# EAGLE design 03_MotorStage_v1 (EAGLE 9.6.2)

## Sheet 1 of 2
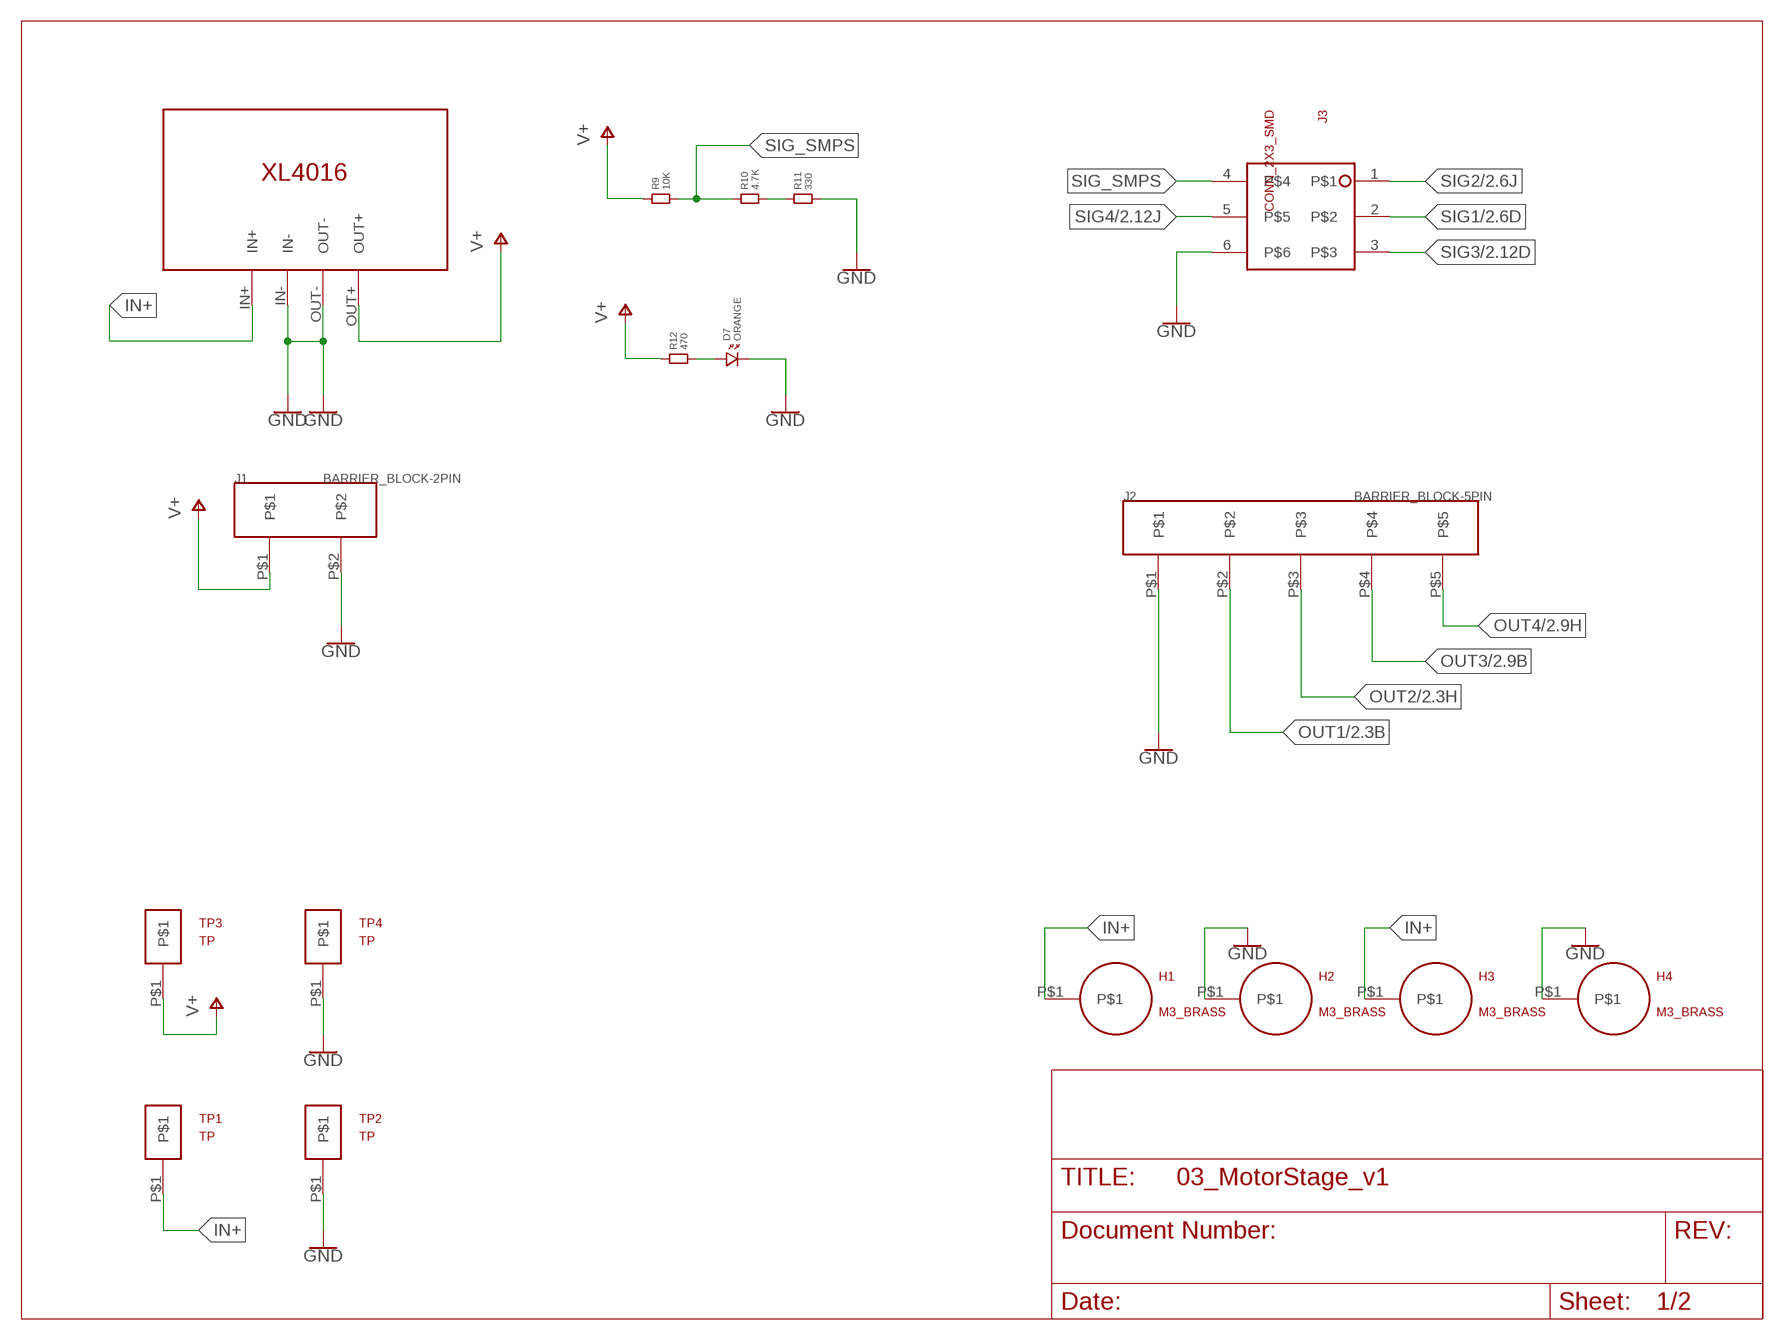
[diagram p0: schematic, sheet 1]

### Parts
D7  ORANGE  LED.1206  [1206.LED]
H1  M3_BRASS  [M3_BRASS]
H2  M3_BRASS  [M3_BRASS]
H3  M3_BRASS  [M3_BRASS]
H4  M3_BRASS  [M3_BRASS]
J1  BARRIER_BLOCK-2PIN  [BARRIERBLOCK-2PIN]
J2  BARRIER_BLOCK-5PIN  [BARRIERBLOCK-5PIN]
J3  CONN_2X3_SMD  [2X3_SMD_CONNECTOR]
R9  10K  RESISTOR.1206  [1206]
R10  4.7K  RESISTOR.1206  [1206]
R11  330  RESISTOR.1206  [1206]
R12  470  RESISTOR.1206  [1206]
TP1  TP  [TP]
TP2  TP  [TP]
TP3  TP  [TP]
TP4  TP  [TP]
U1  XL4016-DEV  [XL4016-DEV]

### Nets
GND: D7.P$2 H2.P$1 H4.P$1 J1.P$2 J2.P$1 J3.6 R11.2 TP2.P$1 TP4.P$1 U1.IN- U1.OUT- ; also sheet 2
IN+: H1.P$1 H3.P$1 TP1.P$1 U1.IN+
N$1: D7.P$1 R12.2
N$23: R10.2 R11.1
OUT1: J2.P$2 ; also sheet 2
OUT2: J2.P$3 ; also sheet 2
OUT3: J2.P$4 ; also sheet 2
OUT4: J2.P$5 ; also sheet 2
SIG1: J3.2 ; also sheet 2
SIG2: J3.1 ; also sheet 2
SIG3: J3.3 ; also sheet 2
SIG4: J3.5 ; also sheet 2
SIG_SMPS: J3.4 R9.2 R10.1
V+: J1.P$1 R9.1 R12.1 TP3.P$1 U1.OUT+ ; also sheet 2

## Sheet 2 of 2
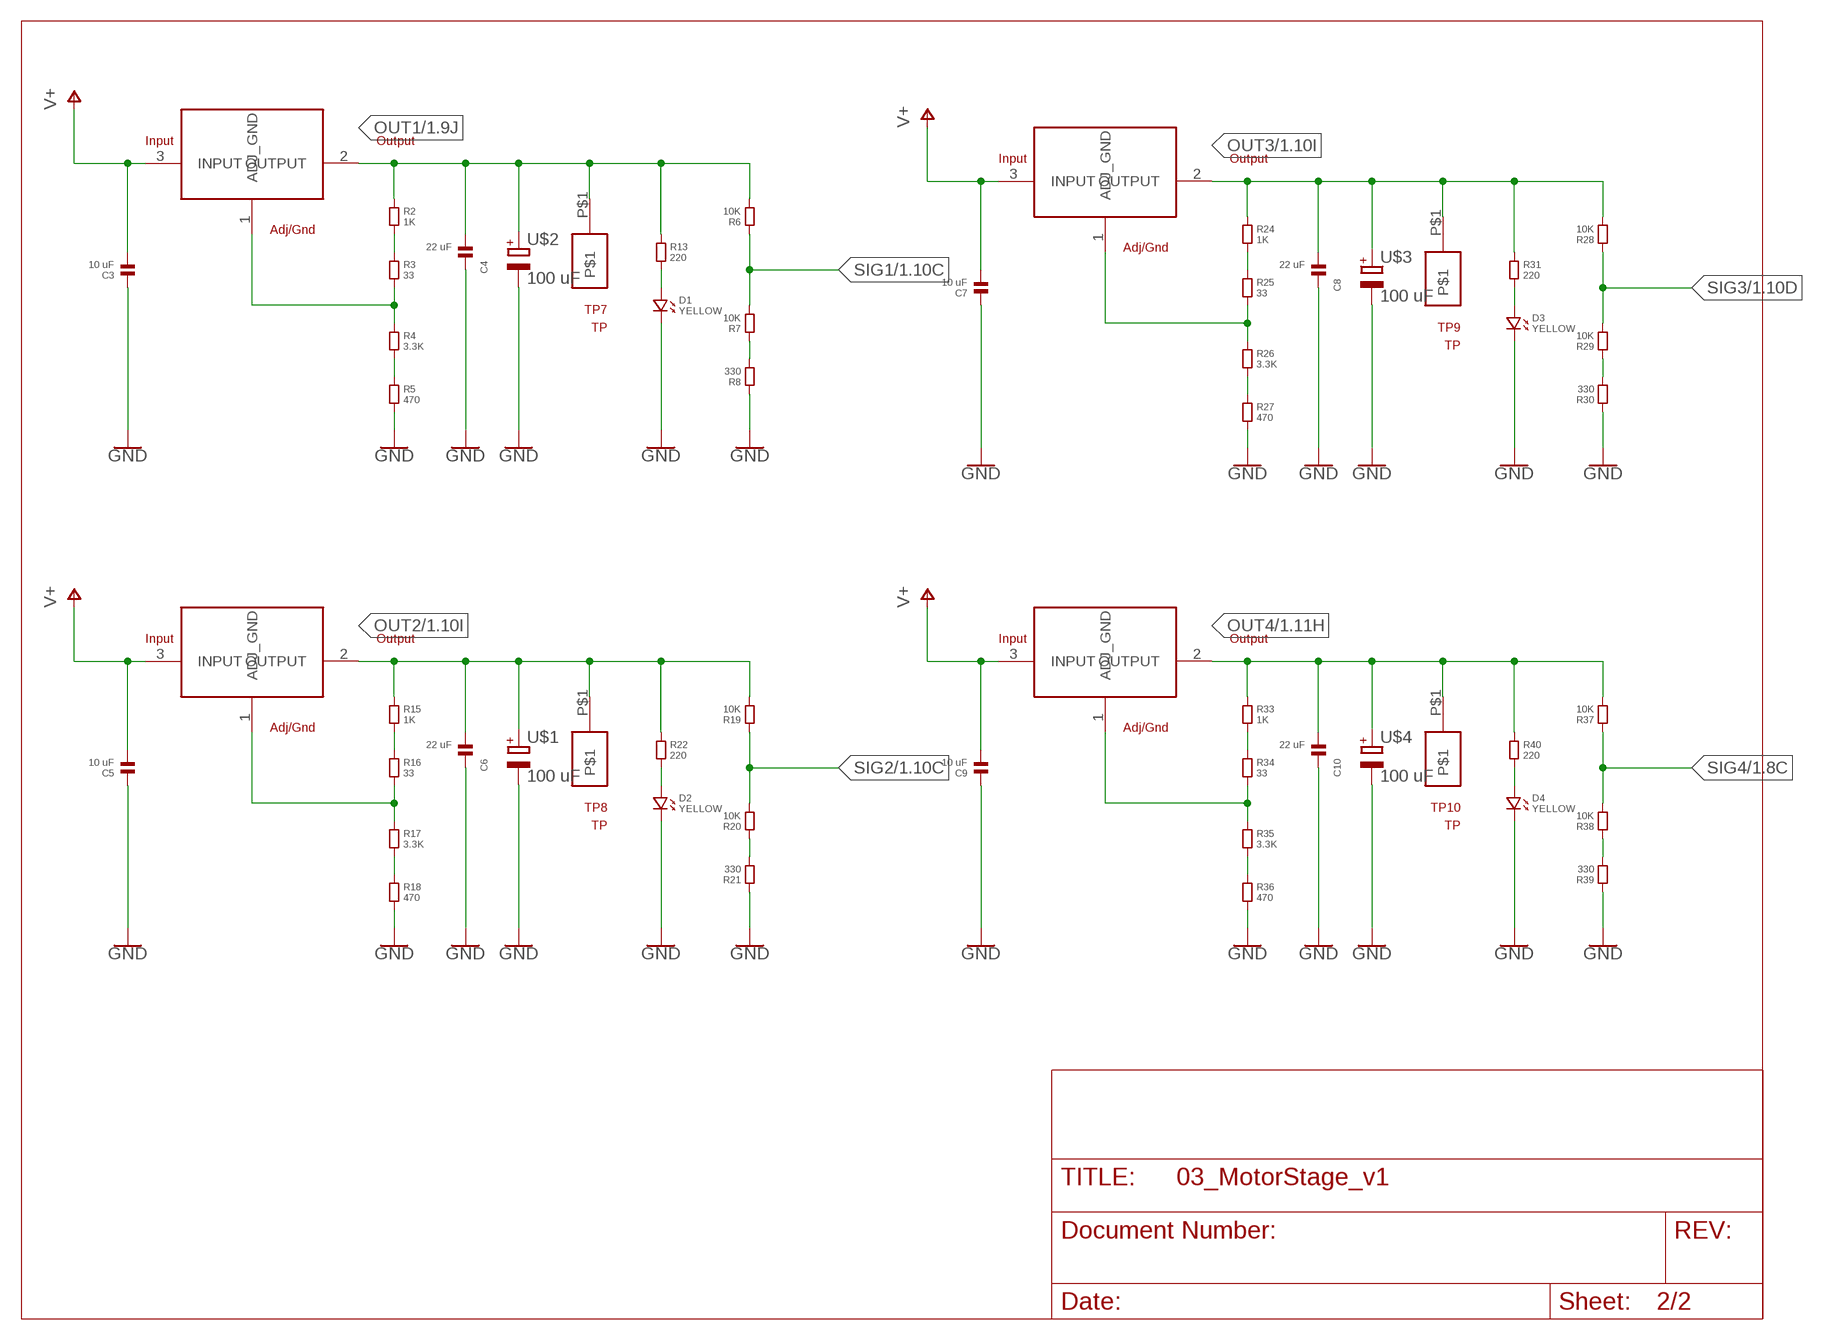
[diagram p1: schematic, sheet 2]

### Parts
C3  10 uF  CAPACITOR.1206  [1206]
C4  22 uF  CAPACITOR.1206  [1206]
C5  10 uF  CAPACITOR.1206  [1206]
C6  22 uF  CAPACITOR.1206  [1206]
C7  10 uF  CAPACITOR.1206  [1206]
C8  22 uF  CAPACITOR.1206  [1206]
C9  10 uF  CAPACITOR.1206  [1206]
C10  22 uF  CAPACITOR.1206  [1206]
D1  YELLOW  LED.1206  [1206.LED]
D2  YELLOW  LED.1206  [1206.LED]
D3  YELLOW  LED.1206  [1206.LED]
D4  YELLOW  LED.1206  [1206.LED]
R1  AZ1084C  [AZ1084C]
R2  1K  RESISTOR.1206  [1206]
R3  33  RESISTOR.1206  [1206]
R4  3.3K  RESISTOR.1206  [1206]
R5  470  RESISTOR.1206  [1206]
R6  10K  RESISTOR.1206  [1206]
R7  10K  RESISTOR.1206  [1206]
R8  330  RESISTOR.1206  [1206]
R13  220  RESISTOR.1206  [1206]
R14  AZ1084C  [AZ1084C]
R15  1K  RESISTOR.1206  [1206]
R16  33  RESISTOR.1206  [1206]
R17  3.3K  RESISTOR.1206  [1206]
R18  470  RESISTOR.1206  [1206]
R19  10K  RESISTOR.1206  [1206]
R20  10K  RESISTOR.1206  [1206]
R21  330  RESISTOR.1206  [1206]
R22  220  RESISTOR.1206  [1206]
R23  AZ1084C  [AZ1084C]
R24  1K  RESISTOR.1206  [1206]
R25  33  RESISTOR.1206  [1206]
R26  3.3K  RESISTOR.1206  [1206]
R27  470  RESISTOR.1206  [1206]
R28  10K  RESISTOR.1206  [1206]
R29  10K  RESISTOR.1206  [1206]
R30  330  RESISTOR.1206  [1206]
R31  220  RESISTOR.1206  [1206]
R32  AZ1084C  [AZ1084C]
R33  1K  RESISTOR.1206  [1206]
R34  33  RESISTOR.1206  [1206]
R35  3.3K  RESISTOR.1206  [1206]
R36  470  RESISTOR.1206  [1206]
R37  10K  RESISTOR.1206  [1206]
R38  10K  RESISTOR.1206  [1206]
R39  330  RESISTOR.1206  [1206]
R40  220  RESISTOR.1206  [1206]
TP7  TP  [TP]
TP8  TP  [TP]
TP9  TP  [TP]
TP10  TP  [TP]
U$1  100 uF  ELECTROLYTIC_CAP  [ELECTROLYTIC_CAP]
U$2  100 uF  ELECTROLYTIC_CAP  [ELECTROLYTIC_CAP]
U$3  100 uF  ELECTROLYTIC_CAP  [ELECTROLYTIC_CAP]
U$4  100 uF  ELECTROLYTIC_CAP  [ELECTROLYTIC_CAP]

### Nets
GND: C3.1 C4.1 C5.1 C6.1 C7.1 C8.1 C9.1 C10.1 D1.P$2 D2.P$2 D3.P$2 D4.P$2 R5.2 R8.1 R18.2 R21.1 R27.2 R30.1 R36.2 R39.1 U$1.- U$2.- U$3.- U$4.- ; also sheet 1
N$3: D1.P$1 R13.2
N$4: R2.2 R3.1
N$5: R1.1(ADJ_GND) R3.2 R4.1
N$6: R4.2 R5.1
N$7: D3.P$1 R31.2
N$8: R7.1 R8.2
N$9: R24.2 R25.1
N$10: D2.P$1 R22.2
N$11: R15.2 R16.1
N$12: R14.1(ADJ_GND) R16.2 R17.1
N$13: R17.2 R18.1
N$14: R20.1 R21.2
N$15: R23.1(ADJ_GND) R25.2 R26.1
N$16: R26.2 R27.1
N$17: R29.1 R30.2
N$18: D4.P$1 R40.2
N$19: R33.2 R34.1
N$20: R32.1(ADJ_GND) R34.2 R35.1
N$21: R35.2 R36.1
N$22: R38.1 R39.2
OUT1: C4.2 R1.2(OUTPUT) R2.1 R6.2 R13.1 TP7.P$1 U$2.+ ; also sheet 1
OUT2: C6.2 R14.2(OUTPUT) R15.1 R19.2 R22.1 TP8.P$1 U$1.+ ; also sheet 1
OUT3: C8.2 R23.2(OUTPUT) R24.1 R28.2 R31.1 TP9.P$1 U$3.+ ; also sheet 1
OUT4: C10.2 R32.2(OUTPUT) R33.1 R37.2 R40.1 TP10.P$1 U$4.+ ; also sheet 1
SIG1: R6.1 R7.2 ; also sheet 1
SIG2: R19.1 R20.2 ; also sheet 1
SIG3: R28.1 R29.2 ; also sheet 1
SIG4: R37.1 R38.2 ; also sheet 1
V+: C3.2 C5.2 C7.2 C9.2 R1.3(INPUT) R14.3(INPUT) R23.3(INPUT) R32.3(INPUT) ; also sheet 1

## Library data of the parts
C3-C10 = standardparts:CAPACITOR
D1-D4 D7 = standardparts:LED
H1-H4 = Hippo-PS:M3_BRASS
J1 = Hippo-PS:BARRIER_BLOCK-2PIN: Barrier block connector Digikey #ED2946-ND
J2 = Hippo-PS:BARRIER_BLOCK-5PIN: Barrier block connector Digikey #ED2946-ND
J3 = Hippo-PS:CONN_2X3_SMD
R1 R14 R23 R32 = Hippo-PS:AZ1084C
R2-R13 R15-R22 R24-R31 R33-R40 = standardparts:RESISTOR
TP1-TP4 TP7-TP10 = Hippo-PS:TP
U1 = Hippo-PS:XL4016-DEV
U$1-U$4 = Hippo-PS:ELECTROLYTIC_CAP: Check availability <https://pricing.snapeda.com/parts/865080545012/Wurth%20Electronics/view-part?ref=eda>; AVAILABILITY: In Stock; DESCRIPTION: 100 µF 35 V Aluminum Electrolytic Capacitors Radial, Can - SMD - 2000 Hrs @ 105°C; MF: Wurth Electronics; MP: 865080545012; PACKAGE: Radial Würth Elektronik; PRICE: None; PURCHASE-URL: https://pricing.snapeda.com/search/part/865080545012/?ref=eda

## Board
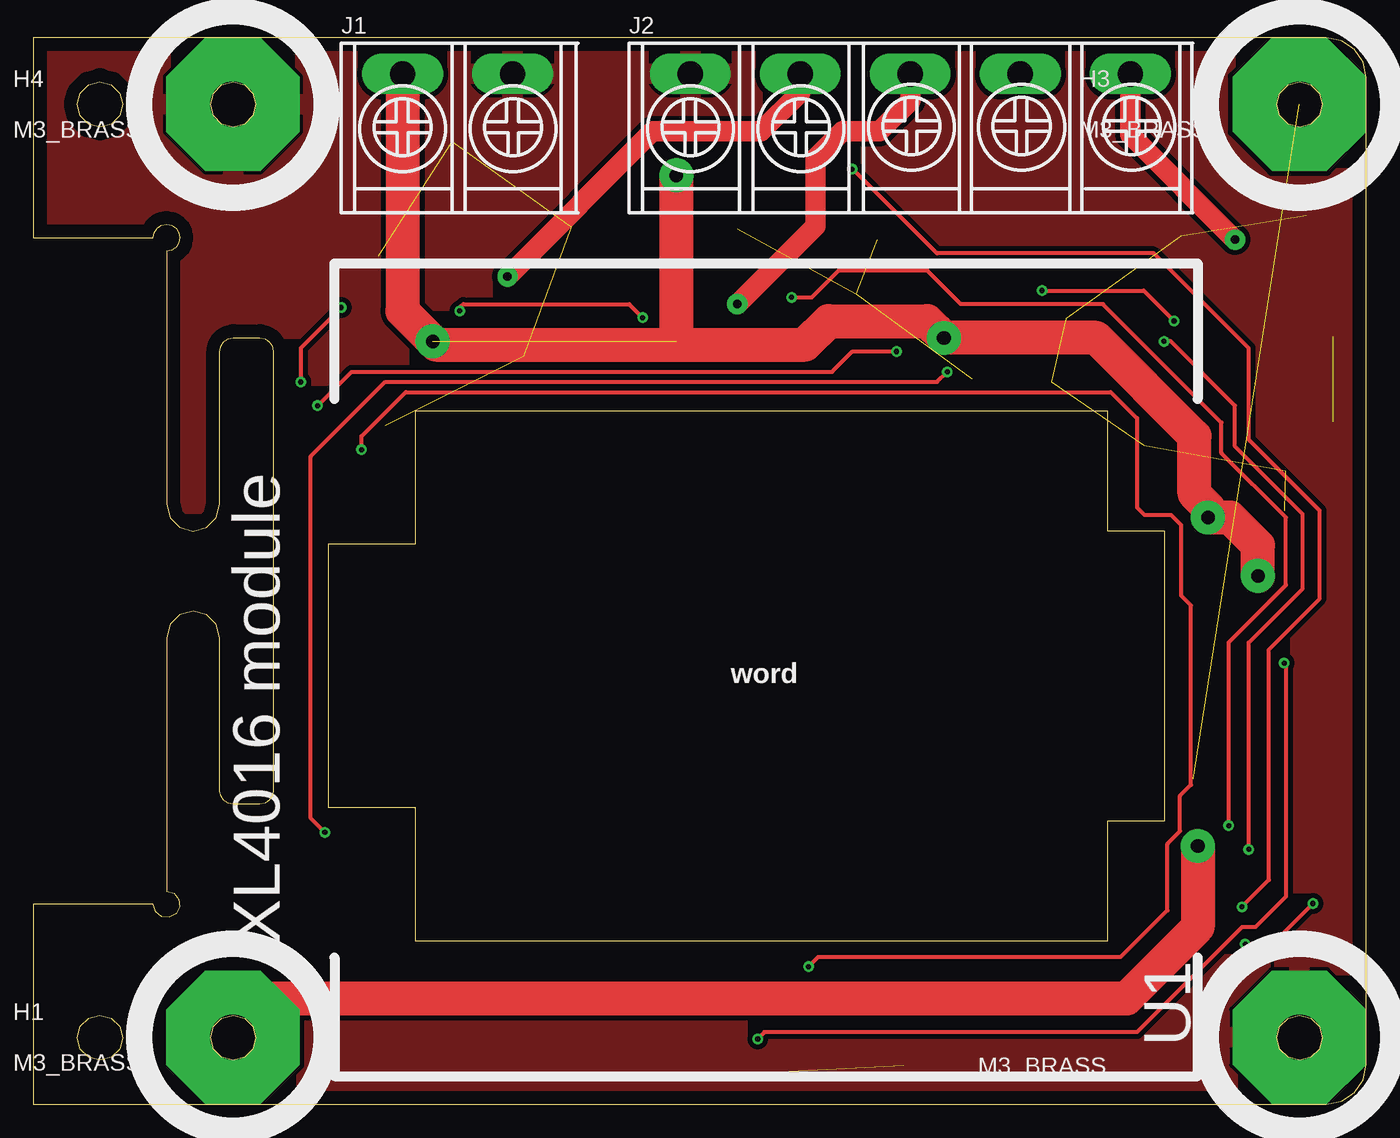
[diagram p2: board, top side]
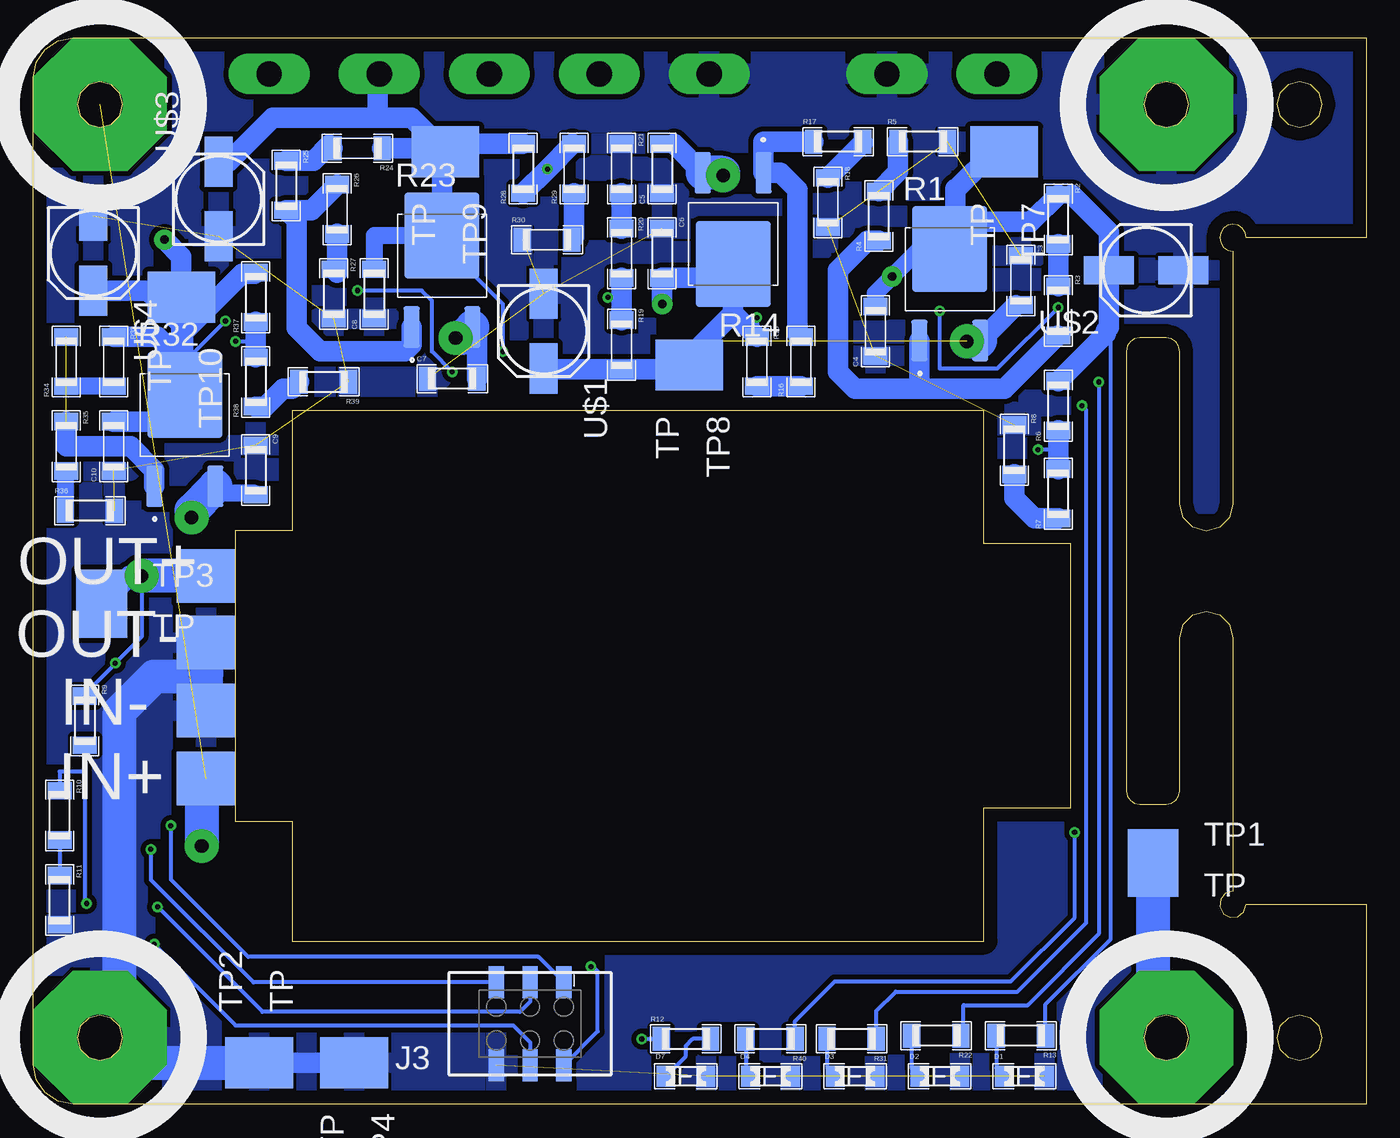
[diagram p3: board, bottom side, seen from below]

Size 100 x 80 mm. Coordinates in mm from the lower left corner, seen from the top.
Outline: 100,77 99.77,78.15 99.12,79.12 98.15,79.77 97,80 0,80 0,65 9,65 9.08,65.39 9.29,65.71 9.61,65.92 10,66 10.39,65.92 10.71,65.71 10.92,65.39 11,65 10.92,64.61 10.71,64.29 10.39,64.08 10,64 10,45 10.27,44 11,43.27 12,43 13,43.27 13.73,44 14,45 14,56.5 14.08,56.89 14.29,57.21 14.61,57.42 15,57.5 17,57.5 17.39,57.42 17.71,57.21 17.92,56.89 18,56.5 18,23.5 17.92,23.11 17.71,22.79 17.39,22.58 17,22.5 15,22.5 14.61,22.58 14.29,22.79 14.08,23.11 14,23.5 14,35 13.73,36 13,36.73 12,37 11,36.73 10.27,36 10,35 10,16 10.56,15.83 10.92,15.38 10.98,14.8 10.71,14.29 10.2,14.02 9.62,14.08 9.17,14.44 9,15 0,15 0,0 97,0 98.15,0.23 99.12,0.88 99.77,1.85 100,3 100,77
Outline: 6.7,75 6.47,74.15 5.85,73.53 5,73.3 4.15,73.53 3.53,74.15 3.3,75 3.53,75.85 4.15,76.47 5,76.7 5.85,76.47 6.47,75.85 6.7,75
Outline: 96.7,75 96.47,74.15 95.85,73.53 95,73.3 94.15,73.53 93.53,74.15 93.3,75 93.53,75.85 94.15,76.47 95,76.7 95.85,76.47 96.47,75.85 96.7,75
Outline: 96.7,5 96.47,4.15 95.85,3.53 95,3.3 94.15,3.53 93.53,4.15 93.3,5 93.53,5.85 94.15,6.47 95,6.7 95.85,6.47 96.47,5.85 96.7,5
Outline: 16.7,75 16.47,74.15 15.85,73.53 15,73.3 14.15,73.53 13.53,74.15 13.3,75 13.53,75.85 14.15,76.47 15,76.7 15.85,76.47 16.47,75.85 16.7,75
Outline: 16.7,5 16.47,4.15 15.85,3.53 15,3.3 14.15,3.53 13.53,4.15 13.3,5 13.53,5.85 14.15,6.47 15,6.7 15.85,6.47 16.47,5.85 16.7,5
Outline: 6.7,5 6.47,4.15 5.85,3.53 5,3.3 4.15,3.53 3.53,4.15 3.3,5 3.53,5.85 4.15,6.47 5,6.7 5.85,6.47 6.47,5.85 6.7,5
Copper layers (1*16): Top 0.035mm / dielectric 1.5mm / Bottom 0.035mm
Design rules "default *": minimum track width 8mil, minimum drill 0.35mm, track to track 10mil, track to pad 10mil, pad to pad 10mil, via to via 10mil, smd to smd 10mil, copper to edge 40mil, drill to drill 10mil, minimum pad ring 10mil, minimum via ring 8mil, stop-mask expansion 4mil, vias tented up to drill 0mil, thermal gap 10mil

### Footprints (pad centres in the part's own frame; a part is rotated, then mirrored left to right if it is on the bottom)
1206 = smd 1.3 x 1.8: 1 -1.85,0; 2 1.85,0
1206.LED = smd 1.4 x 1.6: P$1 -1.5,0; P$2 1.5,0
M3_BRASS = drill 3.4 pad 10 octagon: P$1 0,0
BARRIERBLOCK-2PIN = drill 1.905 pad 3.048 long: P$1 4.6,10.4; P$2 12.85,10.4
BARRIERBLOCK-5PIN = drill 1.905 pad 3.048 long: P$1 4.6,10.4; P$2 12.85,10.4; P$3 21.1,10.4; P$4 29.355,10.4; P$5 37.61,10.4
2X3_SMD_CONNECTOR = smd 1.147 x 2.408: 1 -2.54,-3.104; 2 -2.54,3.104; 3 0,-3.104; 4 0,3.104; 5 2.54,-3.104; 6 2.54,3.104
AZ1084C = smd 1.204 x 3.098: 1 -2.286,-4.26; 3 2.286,-4.26 | smd 5.63 x 6.448: 2 0,2.59
TP = smd 3.81 x 5.08: P$1 0,0
XL4016-DEV = smd 4 x 4.445 bottom: IN+ 10.9,0.334; IN- 16,0.334; OUT+ 26.1,0.334; OUT- 21.1,0.334
ELECTROLYTIC_CAP = smd 3.754 x 2.108: + 2.8,0; - -2.8,0

### Placement (x,y rotation side)
C3  25.9,61.8 270 bottom
C4  36.82,57.99 90 bottom
C5  52.82,70.18 90 bottom
C6  52.82,63.83 270 bottom
C7  68.57,54.44 0 bottom
C8  74.41,60.79 90 bottom
C9  83.3,47.58 270 bottom
C10  93.97,49.36 90 bottom
D1  25.65,2.11 0 bottom
D2  32,2.11 0 bottom
D3  38.35,2.11 0 bottom
D4  44.7,2.11 0 bottom
D7  51.05,2.11 0 bottom
H1  14.98,5.03 0 top
H2  94.99,5.03 0 top
H3  94.99,75.01 0 top
H4  14.98,75.01 0 top
J1  23.11,66.88 0 top
J2  44.7,66.88 0 top
J3  62.73,6.05 180 bottom
R1  31.23,61.55 0 bottom
R2  23.11,66.37 270 bottom
R3  23.11,59.52 270 bottom
R4  36.57,66.63 90 bottom
R5  33.27,72.22 0 bottom
R6  23.11,52.4 90 bottom
R7  23.11,45.8 90 bottom
R8  26.41,49.1 270 bottom
R9  96.13,28.78 270 bottom
R10  98.04,21.67 270 bottom
R11  98.04,15.32 270 bottom
R12  51.05,4.91 0 bottom
R13  25.9,5.16 180 bottom
R14  47.49,65.61 180 bottom
R15  45.71,55.71 270 bottom
R16  42.41,55.71 90 bottom
R17  39.62,72.22 0 bottom
R18  40.38,67.64 270 bottom
R19  55.87,56.98 270 bottom
R20  55.87,63.83 270 bottom
R21  55.87,70.18 270 bottom
R22  32.25,5.16 180 bottom
R23  69.33,62.56 0 bottom
R24  75.68,71.71 180 bottom
R25  81.02,68.91 270 bottom
R26  77.21,67.14 270 bottom
R27  77.46,60.79 270 bottom
R28  63.24,70.18 90 bottom
R29  59.43,70.18 90 bottom
R30  61.46,64.85 0 bottom
R31  38.6,4.91 180 bottom
R32  88.64,50.63 0 bottom
R33  93.97,55.71 270 bottom
R34  97.53,55.71 90 bottom
R35  97.53,49.36 270 bottom
R36  95.75,44.53 0 bottom
R37  83.3,60.53 90 bottom
R38  83.3,54.18 90 bottom
R39  78.22,54.18 180 bottom
R40  44.7,4.91 180 bottom
TP1  15.99,18.11 0 bottom
TP2  83.05,3.13 90 bottom
TP3  94.86,37.54 0 bottom
TP4  75.94,3.13 270 bottom
TP7  27.17,71.45 270 bottom
TP8  50.79,55.45 270 bottom
TP9  69.08,71.45 270 bottom
TP10  88.89,60.53 270 bottom
U1  87.37,13.54 90 top
U$1  61.71,57.99 270 bottom
U$2  16.5,62.56 180 bottom
U$3  86.1,67.9 90 bottom
U$4  95.5,63.83 270 bottom

### Tracks (layer width: path | path; a pad name or v marks a point on that pad's centre or on a via)
GND  (18 unrouted)
  Bottom 1.27: U1.OUT- 87.11,34.56
  Bottom 1.524: TP4.P$1 TP2.P$1
  Bottom 2.54: U1.OUT- 87.03,32.08 | U1.IN- 87.03,32.08 | 87.03,32.08 90.92,32.08 93.51,29.49 93.51,6.51 H2.P$1 93.08,3.13 TP2.P$1
  pour Bottom (isolate 0.381): -4.58,85.93 -4.58,-5.51 107.18,-5.51 107.18,85.93
  pour Top (isolate 0.381): -4.58,83.39 -4.58,-5.51 107.18,-5.51 107.18,85.93 -4.58,85.93
IN+  (via drill 1.02 pad 2.54)  (1 unrouted)
  Top 2.54: H1.P$1 17.9,7.95 82.03,7.95 87.37,13.29 v87.37,19.38
  Bottom 2.54: U1.IN+ 87.37,24.11 v87.37,19.38 | H1.P$1 15.99,6.05 TP1.P$1
N$1
  Bottom 0.305: R12.2 50.54,4.91 51.05,4.4 51.05,3.61 D7.P$1
N$3
  Bottom 0.305: R13.2 27.75,2.72 D1.P$1
N$4
  Bottom 1.524: R2.2 R3.1
N$5
  Bottom 1.524: 33.52,53.69 38.35,53.69 39.62,54.96 39.62,62.56 37.4,64.78 R4.1 | 33.52,53.69 R1.1 | R3.2 23.18,57.67 27.16,53.69 33.52,53.69
N$6
  Bottom 1.524: R5.1 35.12,69.93 R4.2
N$7
  Bottom 0.305: R31.2 40.45,2.72 D3.P$1
N$8
  Bottom 1.524: R8.2 26.41,45.47 24.88,43.95 R7.1
N$9
  Bottom 1.524: R25.1 78.99,70.76 77.79,71.96 R24.2
N$10
  Bottom 0.305: R22.2 34.1,2.72 D2.P$1
N$11
  Bottom 1.524: R15.2 R16.1
N$12
  Bottom 1.27: R16.2 42.66,57.81
  Bottom 1.524: 42.66,57.81 42.66,68.6 43.93,69.87 R14.1 45.2,72.22 R17.1
N$13
  Bottom 1.27: R17.2 37.77,72.11
  Bottom 1.524: R18.1 37.77,72.11
N$14
  Bottom 1.524: R20.1 R21.2
N$15
  Bottom 1.524: R26.1 79.13,67.06 R25.2 80.26,66.3 80.26,58.25 78.48,56.47 72.12,56.47 71.62,56.97 R23.1
N$16
  Bottom 1.27: R27.1 77.21,62.38
  Bottom 1.524: R26.2 77.21,62.38
N$17
  Bottom 1.27: R30.2 59.43,65.03
  Bottom 1.524: R29.1 59.43,65.03
N$18
  Bottom 0.305: R40.2 46.55,2.46 D4.P$1
N$19
  Bottom 1.27: R33.2 R34.1
N$20  (1 unrouted)
  Bottom 1.524: R35.1 97.53,49.36 92.7,49.36 90.92,47.58 R32.1
N$21
  Bottom 1.27: R35.2 97.6,47.43 R36.1
N$22
  Bottom 1.524: R39.2 80.57,53.69 81.25,53.69 82.61,52.33 R38.1
N$23
  Bottom 0.305: R10.2 R11.1
OUT1  (via drill 0.64 pad 1.52)
  Top 1.524: v35.58,62.08 46.47,72.98 54.6,72.98 57.55,75.92 J2.P$2
  Bottom 0.305: R13.1 24.05,7.52 19.17,12.4 19.17,57.43 19.55,57.81
  Bottom 1.27: R1.2 30.83,64.54 | R1.2 29.18,66.19 | R2.1 22.09,68.22 | 21.84,55.52 R6.2 | R1.2 33.52,64.14 v35.58,62.08 36.82,60.84 C4.2 | 30.83,68.66 30.73,68.66 | 27.93,71.45 TP7.P$1
  Bottom 1.524: 30.83,68.66 30.83,64.54 | 29.18,66.19 25.14,66.19 R2.1 | 30.73,68.66 27.93,71.45 | 22.09,68.22 19.3,65.44 U$2.+ 19.3,58.28 19.55,58.03 19.55,57.81 R6.2
OUT2  (via drill 0.38 pad 0.64, 0.64 pad 1.52)
  Top 0.305: v23.11,59.76 20.06,56.72 v20.06,54.18 | v32,59.52 32,59.77 32.25,60.02 44.7,60.02 v45.71,59.01
  Top 1.524: v52.82,60.02 58.67,65.87 58.67,70.95 60.7,72.98 63.49,72.98 65.8,75.28 J2.P$3
  Bottom 0.305: R22.1 30.22,5.34 30.22,7.45 25.39,7.45 20.06,12.78 v20.06,54.18 | v23.11,59.76 27.68,55.19 32,55.19 v32,59.52 | v45.71,59.01 R15.1
  Bottom 1.27: TP8.P$1 50.79,55.13 | U$1.+ 61.65,55.13 | 48.53,61.98 R14.2
  Bottom 1.524: 50.79,55.13 R19.2 61.65,55.13 | 48.53,61.98 C6.2 v52.82,60.02 | R15.1 47.49,59.33 | 47.49,59.33 R14.2 | TP8.P$1 50.79,56.03 47.49,59.33
OUT3  (via drill 0.38 pad 0.64)
  Top 0.305: v21.33,52.4 23.87,54.94 59.94,54.94 61.46,56.47 v64.76,56.47
  Bottom 0.305: R31.1 36.75,7.01 35.3,8.46 26.15,8.46 21,13.62 21,52.07 v21.33,52.4 | R23.2 69.61,64.87 64.76,60.02 v64.76,56.47
  Bottom 1.27: 68.5,72.03 TP9.P$1 | TP9.P$1 69.33,71.2 | C8.2 74.41,65.15 R23.2 | TP9.P$1 69.33,71.71
  Bottom 1.524: 68.5,72.03 R28.2 | 69.33,71.2 R23.2 | R24.1 69.33,71.71 | U$3.+ 85.33,70.7 82.03,73.99 74.16,73.99 | TP9.P$1 71.62,73.99 74.16,73.99 | J2.P$4 74.16,77.17 74.16,73.99
OUT4  (via drill 0.38 pad 0.64, 0.64 pad 1.52)
  Top 0.305: v21.87,20.4 20.82,21.45 20.82,48.59 26.41,54.18 67.81,54.18 v68.57,54.94 | v75.68,61.04 83.3,61.04 v85.59,58.75
  Top 1.524: v90.16,64.85 82.31,72.71 J2.P$5
  Bottom 0.305: R40.1 42.85,6.25 39.87,9.22 26.66,9.22 21.87,14.01 v21.87,20.4 | v68.57,54.94 70.1,56.47 70.1,60.28 70.86,61.04 v75.68,61.04 | v85.59,58.75 88.64,55.71 R32.2
  Bottom 1.27: 90.65,51.21 R32.2 | R32.2 88.64,55.52 | 88.89,53.47 R32.2 | 88.64,58.24 R32.2 | R37.2 83.38,62.31 | 88.64,57.99 R32.2
  Bottom 1.524: C10.2 90.65,51.21 | R33.1 90.67,57.56 88.64,55.52 | 88.89,53.47 TP10.P$1 88.89,63.58 v90.16,64.85 | U$4.+ 91.43,61.03 88.64,58.24 | 83.38,62.31 84.32,62.31 88.64,57.99
SIG1  (via drill 0.38 pad 0.64)
  Top 0.305: v24.63,49.1 24.63,50.12 27.93,53.42 80.84,53.42 82.8,51.46 82.8,44.78 83.38,44.2 85.35,44.2 86.1,43.46 86.1,38.18 86.86,37.42 86.86,23.96 86.04,23.13 86.04,20.5 85.08,19.54 85.08,14.56 81.59,11.07 58.9,11.07 v58.16,10.33
  Bottom 0.305: 23.11,49.1 v24.63,49.1 | J3.2 57.65,5.48 57.65,9.99 58,10.33 v58.16,10.33
  Bottom 1.524: R6.1 23.11,49.1 R7.2
SIG2  (via drill 0.38 pad 0.64)
  Top 0.305: v89.68,20.91 89.68,34.65 93.97,38.94 93.97,44.02 89.15,48.85 89.15,51.13 80.26,60.02 69.59,60.02 67.05,62.56 60.44,62.56 58.41,60.53 v56.89,60.53
  Bottom 0.305: J3.1 62.11,11.07 83.88,11.07 89.68,16.87 v89.68,20.91 | v56.89,60.53 55.87,60.53
  Bottom 1.524: R20.2 55.87,60.53 R19.1
SIG3  (via drill 0.38 pad 0.64)
  Top 0.305: v90.67,14.81 92.7,16.84 92.7,34.12 96.51,37.93 96.51,44.53 91.18,49.86 91.18,56.72 84.07,63.83 67.81,63.83 61.46,70.18 v61.42,70.15
  Bottom 0.305: J3.3 62.73,7.7 63.49,6.94 82.8,6.94 v90.67,14.81
  Bottom 1.27: R29.2 59.54,72.03
  Bottom 1.524: R28.1 v61.42,70.15 59.54,72.03
SIG4  (via drill 0.38 pad 0.64)
  Top 0.305: v91.18,19.13 91.18,34.62 95.24,38.69 95.24,44.28 90.16,49.36 90.16,52.4 85.34,57.23 v84.83,57.23
  Bottom 0.305: v91.18,19.13 91.18,16.84 83.49,9.15 J3.5 | v84.83,57.23 83.3,57.23
  Bottom 1.524: R37.1 83.3,57.23 R38.2
SIG_SMPS  (via drill 0.38 pad 0.64)
  Top 0.305: v96,15.07 92.96,12.02 v90.92,12.02
  Bottom 0.305: R9.2 96.13,24.97 | R10.1 98.04,24.97 96.13,24.97 | v90.92,12.02 84.83,5.92 64,5.92 62.73,4.65 J3.4 | 96.13,24.97 96.13,15.19 v96,15.07
V+  (via drill 0.38 pad 0.64, 1.02 pad 2.54)  (1 unrouted)
  Top 0.305: v93.85,33.1 93.97,32.97 93.97,15.57 91.69,13.29 90.67,13.29 82.8,5.41 54.86,5.41 v54.35,4.91
  Top 2.54: v91.88,39.64 91.88,41.93 89.78,44.02 v88.13,44.02 | v88.13,44.02 | v88.13,44.02 88.13,44.78 87.11,45.8 87.11,50.12 79.75,57.48 v68.32,57.48 67.05,58.75 59.68,58.75 57.9,56.98 30.22,56.98 v29.96,57.23 27.71,59.49 J1.P$1 | 48.25,57.23 v48.25,69.68
  Bottom 0.305: v91.88,39.64 91.88,35.07 v93.85,33.1 93.85,33.04 96.13,30.76 R9.1 | v54.35,4.91 R12.1
  Bottom 1.27: C3.2 26.28,59.95 | C5.2 51.94,72.03 | 66.72,57.89 66.75,58.01 R23.3 | C9.2 83.43,45.86 85.84,45.86 R32.3
  Bottom 1.524: R1.3 26.28,59.95 | 51.94,72.03 R14.3 | 66.72,57.89 C7.2 | v91.88,39.64 92.76,39.64 TP3.P$1
  Bottom 2.54: U1.OUT+ v91.88,39.64 | R32.3 86.35,46.31 88.13,44.53 v88.13,44.02 | v68.32,57.48 67.87,57.48 R23.3 | v29.96,57.23 29.01,57.23 R1.3 | v48.25,69.68 48.25,69.87 R14.3

### Text on the board
tNames: word